# EAGLE design MainBoard 1.4.1 (EAGLE 9.5.1)
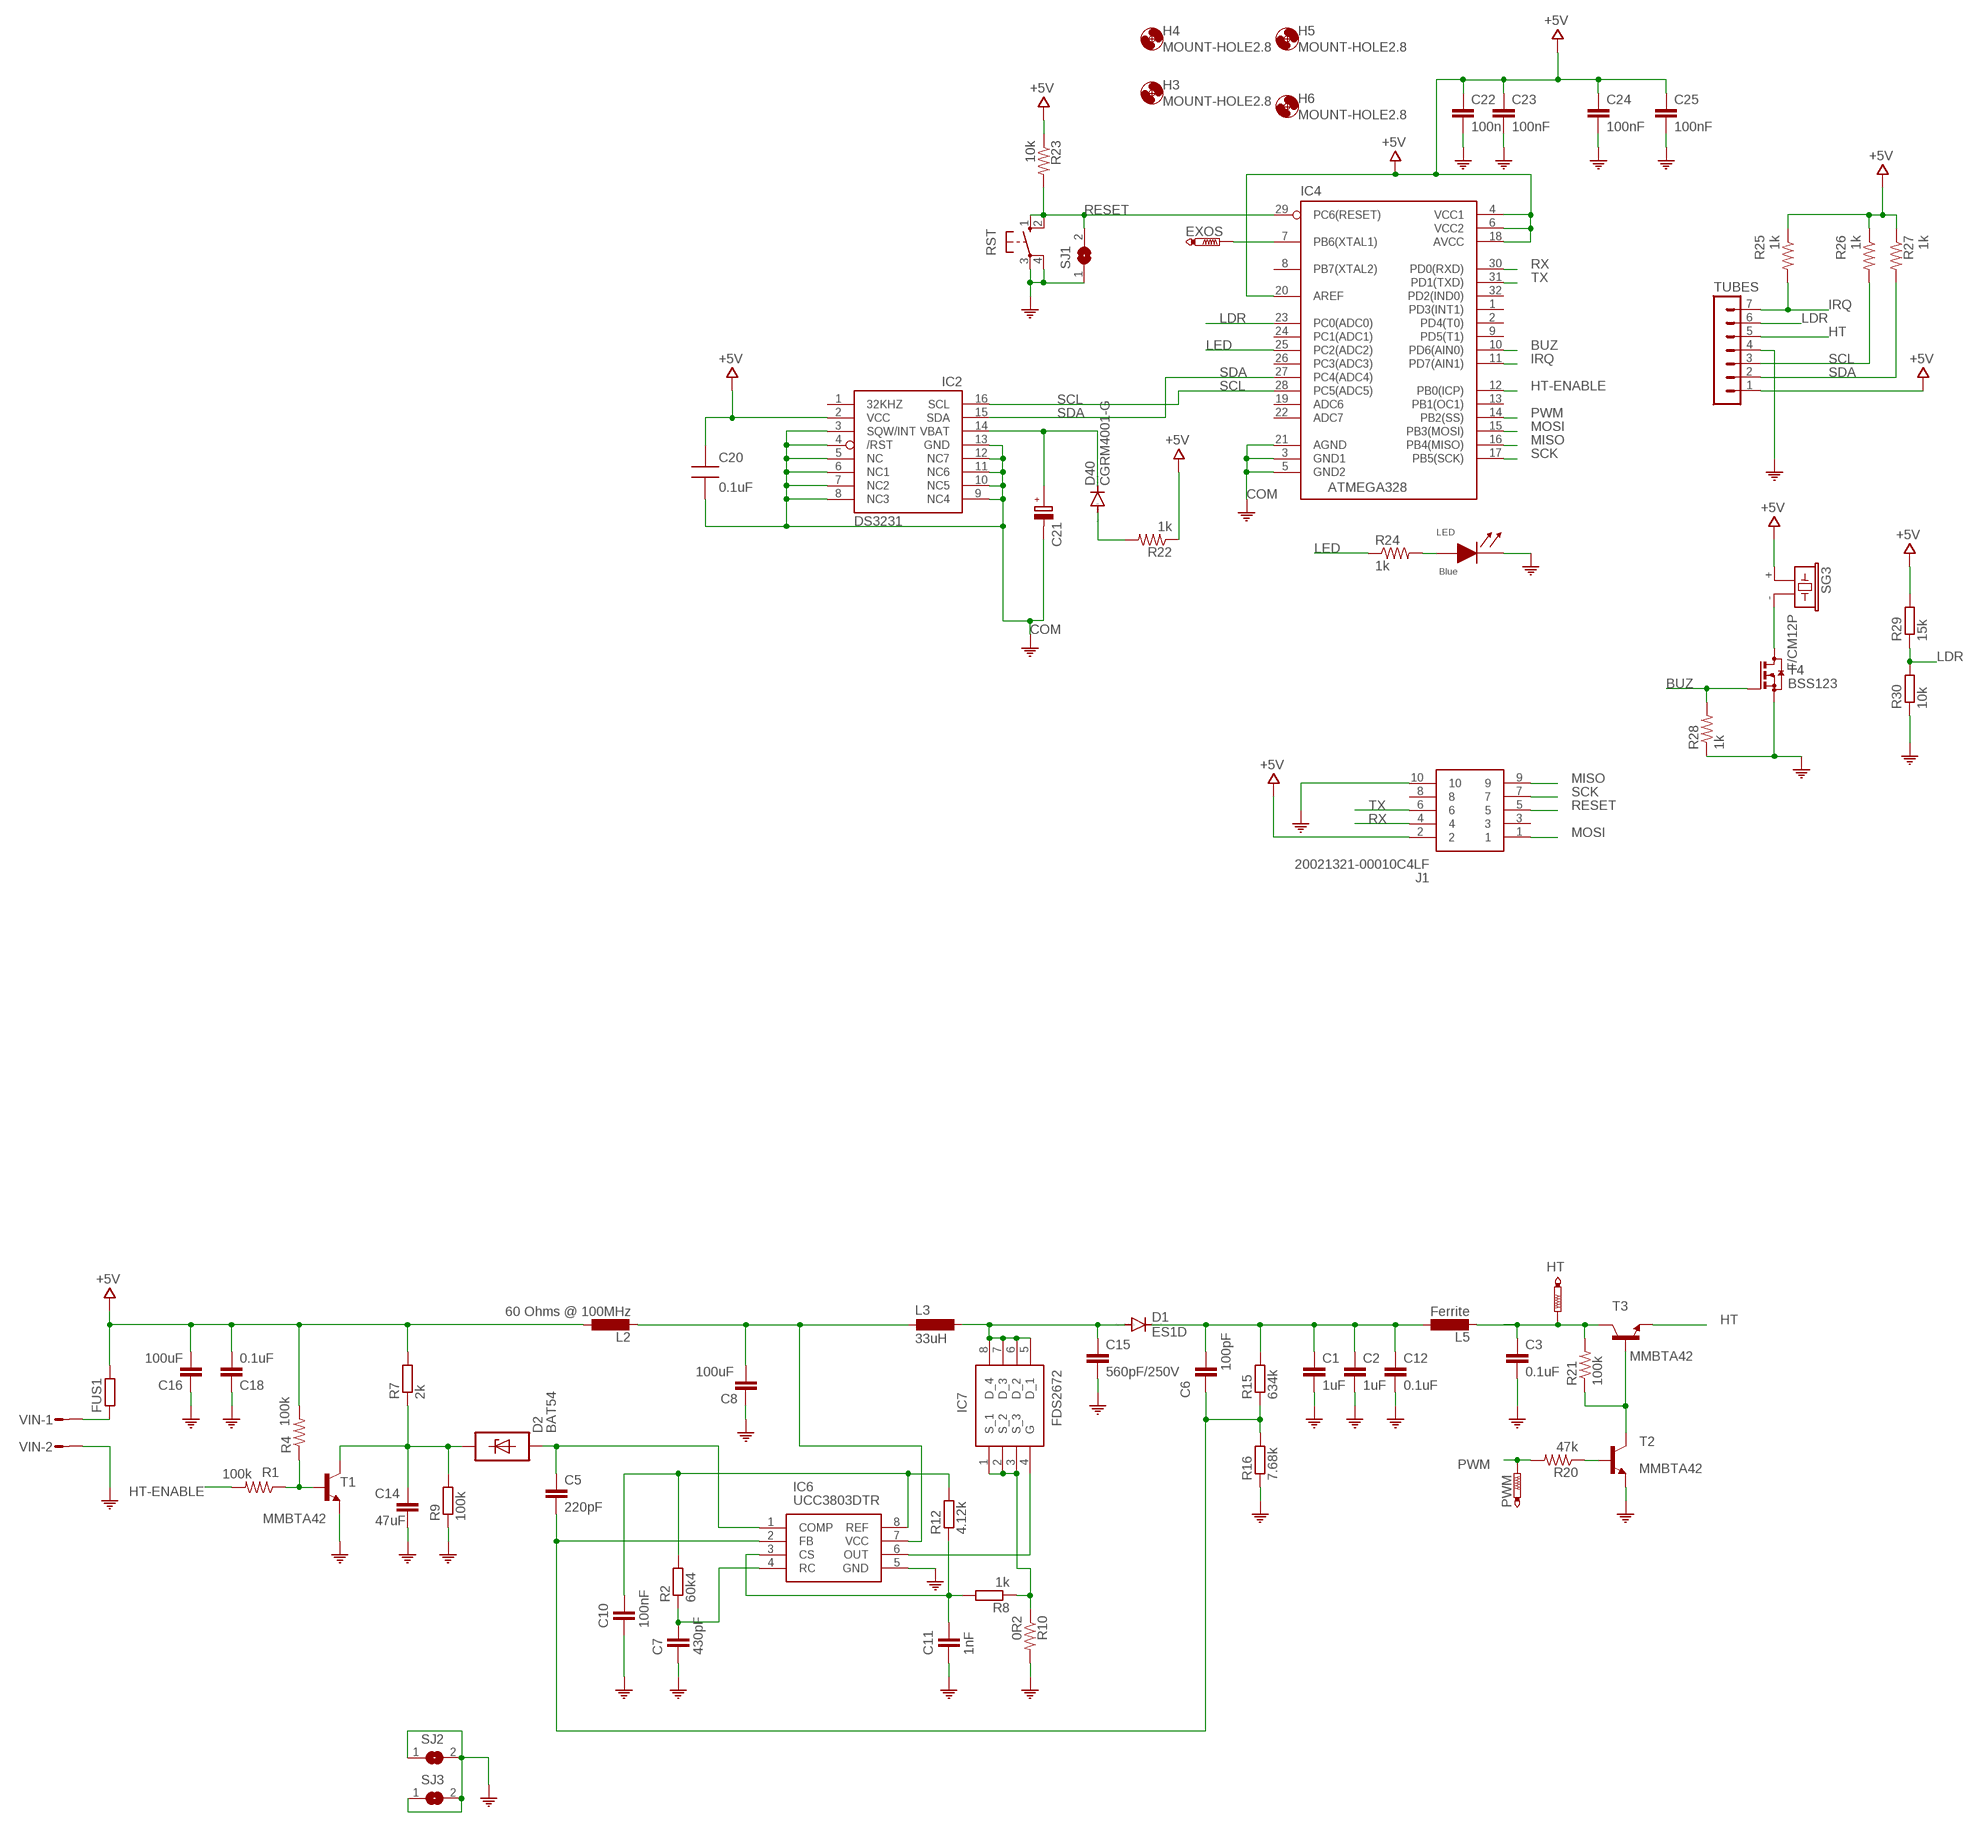
[diagram p0: schematic, sheet 1]

## Parts
C1  1uF  C-EUC1812K  [C1812K]
C2  1uF  C-EUC1812K  [C1812K]
C3  0.1uF  C-EUC1808  [C1808]
C5  220pF  C-EUC0805K  [C0805K]
C6  100pF  C-EUC0805  [C0805]
C7  430pF  C-EUC0805  [C0805]
C8  100uF  C-EUC1210  [C1210]
C10  100nF  C-EUC0805  [C0805]
C11  1nF  C-EUC0805  [C0805]
C12  0.1uF  C-EUC1808  [C1808]
C14  47uF  C-EUC1210  [C1210]
C15  560pF/250V  C-EUC0603  [C0603]
C16  100uF  C-EUC1210  [C1210]
C18  0.1uF  C-EUC0805  [C0805]
C20  0.1uF  CAP0805-NP  [CAP0805-NP]
C21  AHG-35/100-RADIAL  [ELNA21.5X8.0]
C22  100n  C-EUC0603  [C0603]
C23  100nF  C-EUC0603  [C0603]
C24  100nF  C-EUC0603  [C0603]
C25  100nF  C-EUC0603  [C0603]
D1  ES1D  ES2D  [SMB]
D2  BAT54  SP4020-01FTG  [SOD323]
D40  CGRM4001-G  [SOD-123_MINI-SMA]
EXOS  PTR1TP09R  [TP09R]
FUS1  R-EU_R6332  [R6332]
H3  MOUNT-HOLE2.8  [2,8]
H4  MOUNT-HOLE2.8  [2,8]
H5  MOUNT-HOLE2.8  [2,8]
H6  MOUNT-HOLE2.8  [2,8]
HT  PTR1TP09R  [TP09R]
IC2  DS3231/SO  [SO16W]
IC4  ATMEGA328  ATMEGA168-20AU  [QFP032]
IC6  UCC3803DTR  [SOIC127P600X175-8N]
IC7  FDS2672  [SOIC127P600X175-8N]
J1  20021321-00010C4LF  [2002132100010C4LF]
L2  60 Ohms @ 100MHz  L-EUL2012C  [L2012C]
L3  33uH  MSS7341  [MSS7341]
L5  Ferrite  L-EUL2012C  [L2012C]
LED  Blue  LED0805  [LED0805]
PWM  PTR1TP09R  [TP09R]
R1  100k  R-US_R0805  [R0805]
R2  60k4  R-EU_R0805  [R0805]
R4  100k  R-US_R0805  [R0805]
R7  2k  R-EU_R0805  [R0805]
R8  1k  R-EU_R0805  [R0805]
R9  100k  R-EU_R0805  [R0805]
R10  0R2  R-US_R2010  [R2010]
R12  4.12k  R-EU_R0805  [R0805]
R15  634k  R-EU_R0805  [R0805]
R16  7.68k  R-EU_R0805  [R0805]
R20  47k  R-US_R2012  [R2012]
R21  100k  R-US_R2012  [R2012]
R22  1k  R-US_M2012  [M2012]
R23  10k  R-US_M2012  [M2012]
R24  1k  R-US_M2012  [M2012]
R25  1k  R-US_M2012  [M2012]
R26  1k  R-US_M2012  [M2012]
R27  1k  R-US_M2012  [M2012]
R28  1k  R-US_M2012  [M2012]
R29  15k  R-EU_0204/2V  [0204V]
R30  10k  R-EU_M2012  [M2012]
RST  10-XX  [B3F-10XX]
SG3  F/CM12P  [F/CM12P]
SJ1  SJW  [SJW]
SJ2  SJW  [SJW]
SJ3  SJW  [SJW]
T1  MMBTA42  BC846  [SOT23]
T2  MMBTA42  BC846  [SOT23]
T3  MMBTA42  BC846  [SOT23]
T4  BSS123  [SOT23]
TUBES  MA07-1  [MA07-1]
VIN  M02S  [02P]

## Nets
+5V [pwr]: C16.2 C18.1 C20.1 C22.1 C23.1 C24.1 C25.1 FUS1.2 IC2.2(VCC) IC4.4(VCC1) IC4.6(VCC2) IC4.18(AVCC) IC4.20(AREF) J1.2 L2.1 R4.2 R7.2 R22.1 R23.1 R25.1 R26.1 R27.1 R29.2 SG3.+ TUBES.1
BATT: C21.+ D40.C IC2.14(VBAT)
BUZ: IC4.10(PD6(AIN0)) R28.2 T4.1(G)
COM: C1.2 C2.2 C3.2 C7.2 C8.1 C10.2 C11.2 C12.2 C14.2 C15.2 C16.1 C18.2 C20.2 C21.- C22.2 C23.2 C24.2 C25.2 IC2.3(SQW/INT) IC2.4(/RST) IC2.5(NC) IC2.6(NC1) IC2.7(NC2) IC2.8(NC3) IC2.9(NC4) IC2.10(NC5) IC2.11(NC6) IC2.12(NC7) IC2.13(GND) IC4.3(GND1) IC4.5(GND2) IC4.21(AGND) IC6.5(GND) J1.10 LED.1(CA) R9.1 R10.2 R16.1 R28.1 R30.1 RST.3(P) RST.4(P1) SJ1.1 SJ2.1 SJ2.2 SJ3.1 SJ3.2 T1.2(E) T2.2(E) T4.2(S) TUBES.4 VIN.2
CS: C11.1 IC6.3(CS) R8.2 R12.1
FB: C5.2 C6.2 IC6.2(FB) R15.1 R16.2
HT: T3.2(E) TUBES.5
HT-ENABLE: IC4.12(PB0(ICP)) R1.2
IRQ: IC4.11(PD7(AIN1)) R25.2 TUBES.7
LDR: IC4.23(PC0(ADC0)) R29.1 R30.2 TUBES.6
LED: IC4.25(PC2(ADC2)) R24.1
MISO: IC4.16(PB4(MISO)) J1.9
MOSI: IC4.15(PB3(MOSI)) J1.1
N$3: SG3.- T4.3(D)
N$5: EXOS.TP IC4.7(PB6(XTAL1))
N$6: C1.1 C2.1 C6.1 C12.1 D1.C L5.1 R15.2
N$7: R21.1 T2.3(C) T3.1(B)
N$8: R1.1 R4.1 T1.1(B)
N$9: C14.1 D2.C R7.1 R9.2 T1.3(C)
N$10: C5.1 D2.A IC6.1(COMP)
N$12: IC7.1(S_1) IC7.2(S_2) IC7.3(S_3) R8.1 R10.1
N$14 [pwr]: FUS1.1 VIN.1
N$15: LED.2(AN) R24.2
N$18: C15.1 D1.A IC7.5(D_1) IC7.6(D_2) IC7.7(D_3) IC7.8(D_4) L3.2
N$19: R20.1 T2.1(B)
N$23: D40.A R22.2
OUT: IC6.6(OUT) IC7.4(G)
PWM: IC4.14(PB2(SS)) PWM.TP R20.2
RAW_HT: C3.1 HT.TP L5.2 R21.2 T3.3(C)
RC: C7.1 IC6.4(RC) R2.1
REF: C10.1 IC6.8(REF) R2.2 R12.2
RESET: IC4.29(PC6(RESET)) J1.5 R23.2 RST.1(S) RST.2(S1) SJ1.2
RX: IC4.30(PD0(RXD)) J1.4
SCK: IC4.17(PB5(SCK)) J1.7
SCL: IC2.16(SCL) IC4.28(PC5(ADC5)) R26.2 TUBES.3
SDA: IC2.15(SDA) IC4.27(PC4(ADC4)) R27.2 TUBES.2
TX: IC4.31(PD1(TXD)) J1.6
VCC [pwr]: C8.2 IC6.7(VCC) L2.2 L3.1
Unconnected: IC2.1(32KHZ) IC4.1(PD3(INT1)) IC4.2(PD4(T0)) IC4.8(PB7(XTAL2)) IC4.9(PD5(T1)) IC4.13(PB1(OC1)) IC4.19(ADC6) IC4.22(ADC7) IC4.24(PC1(ADC1)) IC4.26(PC3(ADC3)) IC4.32(PD2(IND0)) J1.3 J1.8

## Library data of the parts
C1 C2 = rcl:C-EU: CAPACITOR, European symbol; MOUSER: 810-C4532X7T2E105MST; SPICEPREFIX: C; TDK: C4532X7T2E105M250KE
C3 C12 = rcl:C-EU: CAPACITOR, European symbol; KEMET: CAN17C104KARACTU; MOUSER: 80-CAN17C104KARACTU; SPICEPREFIX: C
C5 C14 C15 C18 C22-C25 = rcl:C-EU: CAPACITOR, European symbol; SPICEPREFIX: C
C6 C7 C10 C11 = rcl:C-EU: CAPACITOR, European symbol; MOUSER: 791-0603X106K100CT; SPICEPREFIX: C
C8 C16 = rcl:C-EU: CAPACITOR, European symbol; MOUSER: 963-EMK325ABJ107MM-P; SPICEPREFIX: C; TAIYO_YUDEN: EMK325ABJ107MM-P
C20 = MySMD:CAP0805-NP
C21 = Elkos:AHG-35/100-RADIAL: AUDYN® - AHG Gepolt, radial High Grade AHG Gepolter Elekrolytkondensator für Audio-Netzteile, oder Verstärker im Home- und Car-Bereich. Technische Daten Anschlußdrähte: Kupfer, verzinnt AL: ? mm d2ø : ? mm Kapazitätsbereich: von 10 µF bis 2200 µF Nennspannungen: 25 V, 35 V, 50 V, 100 V C-Toleranz: 20 % ( bei 20° C ) Verlustfaktor: tan δ < 0,100 @ 1 kHz Temperaturbereich: - 40° C bis 85° C Verzerrung: sehr gering bei 10 kHz, 010 A - 120 dB oder niedriger gepolt AHG AUDYN® - AHG gepolt Bezeichnung C U DxH Rm Bestell.-Nr. U / Volt D x L/mm mm AHG/10.0/100V 10µF 100V 10x15 5,0 1341690 AHG/22.0/50V 22µF 50V 10x13 5,0 1341691 AHG/47.0/50V 47µF 50V 10x16 5,0 1341692 AHG/100.0/50V 100µF 50V 13x21 5,0 1341693 AHG/220.0/50V 220µF 50V 16x25 7,5 1341694 AHG/470.0/50V 470µF 50V 16x37 7,5 1341695 AHG/1000/35V 1000µF 35V 18x37 7,5 1341696 AHG/2200/35V 2200µF 35V 22x38 10,0 1341697 Alle Abmessungen in mm; MOUSER: 555-DB-5R5D474T
D1 = diode:ES2D: DIODE super fast rectifier, 2 A
D2 = sp4020_11:SP4020-01FTG: SP4020 Series 2.5pF, 30A Discrete TVS Diode Source: http://www.littelfuse.com/~/media/electronics/datasheets/tvs_diode_arrays/littelfuse_tvs_diode_array_sp4020_datasheet.pdf.pdf; MF: Littelfuse; MPN: SP4020-01FTG; OC_FARNELL: unknown; OC_NEWARK: 05X0400
D40 = diode:CGRM400*-G: Molded plasitc,JEDEC SOD-123/Mini SMA Source: Comchip CGRM4001-G.pdf; MOUSER: 863-NSR0320MW2T1G
EXOS HT PWM = testpad:PTR1: TEST PIN
FUS1 = rcl:R-EU_: RESISTOR, European symbol; MOUSER: 530-0ZCG0150AF2C; SPICEPREFIX: R
H3-H6 = holes:MOUNT-HOLE: MOUNTING HOLE with drill center marker
IC2 = DS3231:DS3231: The DS3231 is a low-cost, extremely accurate I²C real-time clock (RTC) with an integrated temperature-compensated crystal oscillator (TCXO) and crystal. The device incorporates a battery input, and maintains accurate timekeeping when main power to the device is interrupted.; AVAILABILITY: Unavailable; MF: Maxim Integrated; MP: DS3231; PACKAGE: SOIC-16 Maxim Integrated; PRICE: None
IC4 = MySMD:ATMEGA168-20AU
IC6 = UCC3803DTR:UCC3803DTR: Switching Controllers Low-Power BiCMOS Current-Mode PWM Source: Datasheet <http://www.ti.com/lit/ds/symlink/ucc3803.pdf>; DESCRIPTION: Switching Controllers Low-Power BiCMOS Current-Mode PWM; HEIGHT: 1.75mm; MANUFACTURER_NAME: Texas Instruments; MANUFACTURER_PART_NUMBER: UCC3803DTR; MOUSER_PART_NUMBER: 595-UCC3803DTR; MOUSER_PRICE-STOCK: https://www.mouser.com/Search/Refine.aspx?Keyword=595-UCC3803DTR
IC7 = FDS2672:FDS2672: FDS2672, N-channel MOSFET Transistor 3.9 A 200 V, 8-Pin SOIC Source: Datasheet <http://docs-emea.rs-online.com/webdocs/0d23/0900766b80d23481.pdf>; DESCRIPTION: FDS2672, N-channel MOSFET Transistor 3.9 A 200 V, 8-Pin SOIC; HEIGHT: 1.75mm; MANUFACTURER_NAME: Fairchild Semiconductor; MANUFACTURER_PART_NUMBER: FDS2672; MOUSER_PART_NUMBER: 512-FDS2672; MOUSER_PRICE-STOCK: https://www.mouser.com/Search/Refine.aspx?Keyword=512-FDS2672; RS_PART_NUMBER: 6710481P; RS_PRICE-STOCK: http://uk.rs-online.com/web/p/products/6710481P
J1 = SamacSys_Parts:20021321-00010C4LF: Headers & Wire Housings 1.27x1.27mm BTB, Hdr Recept, SMT, 10 Pos Source: Datasheet <https://componentsearchengine.com/Datasheets/1/20021321-00010C4LF.pdf>; DESCRIPTION: Headers & Wire Housings 1.27x1.27mm BTB, Hdr Recept, SMT, 10 Pos; HEIGHT: 4.75mm; MANUFACTURER_NAME: Amphenol; MANUFACTURER_PART_NUMBER: 20021321-00010C4LF; MOUSER_PART_NUMBER: 649-202132100010C4LF; MOUSER_PRICE-STOCK: https://www.mouser.com/Search/Refine.aspx?Keyword=649-202132100010C4LF
L2 L5 = rcl:L-EU: INDUCTOR, European symbol; SPICEPREFIX: L
L3 = STEAM-inductor-coilcraft:MSS7341: Shielded Power Inductors Package 6.6 × 6.6 mm x 4.1 mm high Source: http://www.farnell.com/datasheets/1681958.pdf; MOUSER: 710-784770330
LED = MySMD:LED0805
R1 R4 R10 R20-R28 = adafruit:R-US_: RESISTOR, American symbol
R2 R8 R9 = rcl:R-EU_: RESISTOR, European symbol; SPICEPREFIX: R
R7 = rcl:R-EU_: RESISTOR, European symbol; MOUSER: 754-RR1220P-202D; SPICEPREFIX: R; SUSUMU: RR1220P-202-D
R12 = rcl:R-EU_: RESISTOR, European symbol; KOASPEER: RN732ATTD4121F100; MOUSER: 660-RN732ATD4121F100; SPICEPREFIX: R
R15 = rcl:R-EU_: RESISTOR, European symbol; MOUSER: 71-CRCW0603-634K-E3; SPICEPREFIX: R; VISHAY: CRCW0603634KFKEA
R16 = rcl:R-EU_: RESISTOR, European symbol; MOUSER: 71-CRCW0805-7.68K-E3; SPICEPREFIX: R; VISHAY: CRCW08057K68FKEA
R29 R30 = resistor:R-EU_: RESISTOR, European symbol
RST = switch-omron:10-XX: OMRON SWITCH; MPN: B3F-1000; OC_FARNELL: 176432; OC_NEWARK: 36M3542
SG3 = buzzer:F/CM12P: BUZZER Source: Buerklin; OC_FARNELL: unknown; OC_NEWARK: unknown
SJ1-SJ3 = jumper:SJ: SMD solder JUMPER
T1-T3 = transistor:BC846: NPN TRANSISTOR
T4 = transistor-small-signal:BSS123: N-CHANNEL MOS FET
TUBES = con-lstb:MA07-1: PIN HEADER; OC_FARNELL: unknown; OC_NEWARK: unknown
VIN = con-amp-quick:M02S: AMP QUICK CONNECTOR; OC_FARNELL: unknown; OC_NEWARK: unknown

## Module TUBEIN16
Ports: 

### Library data of the parts

## Net classes
0 default: width 0.254 mm, clearance 0.254 mm
1 pwr: width 0.254 mm, clearance 0.356 mm

## Board
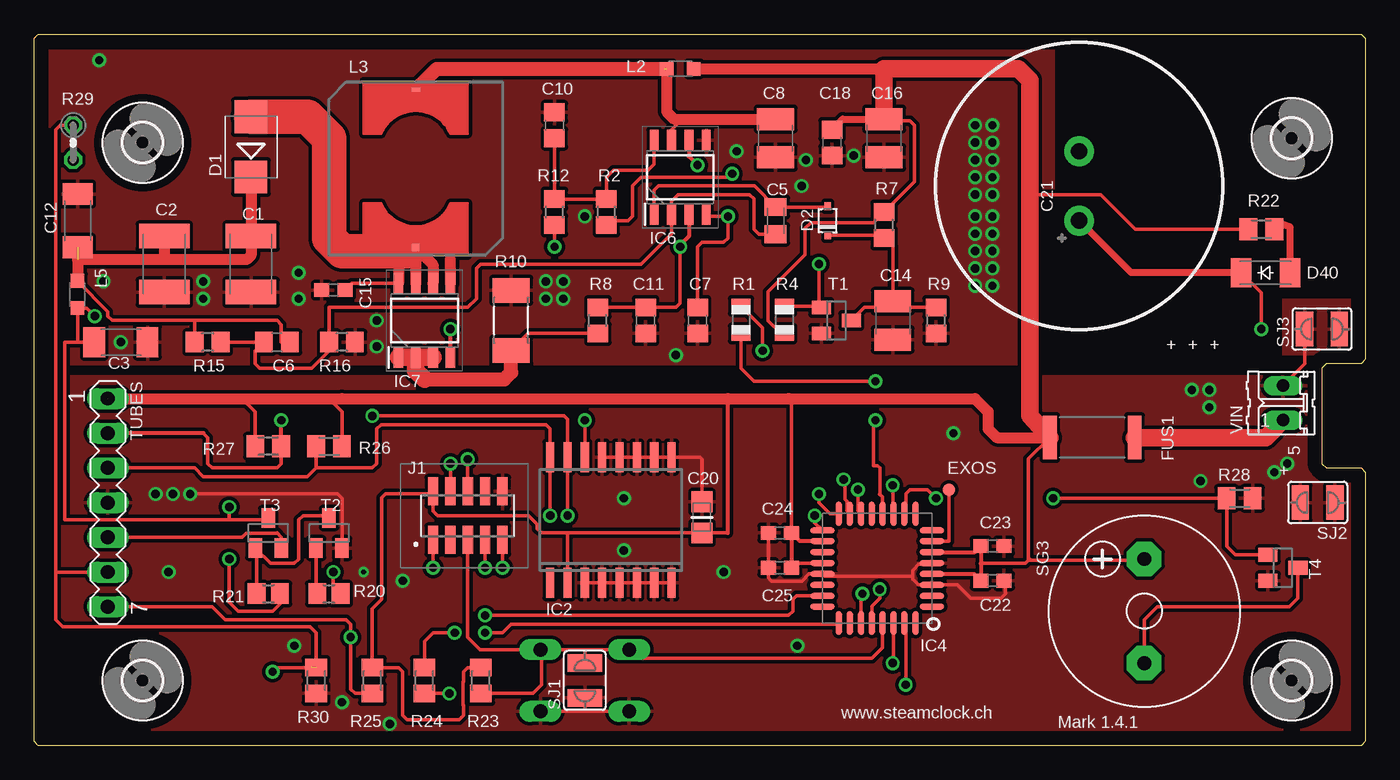
[diagram p1: board, top side]
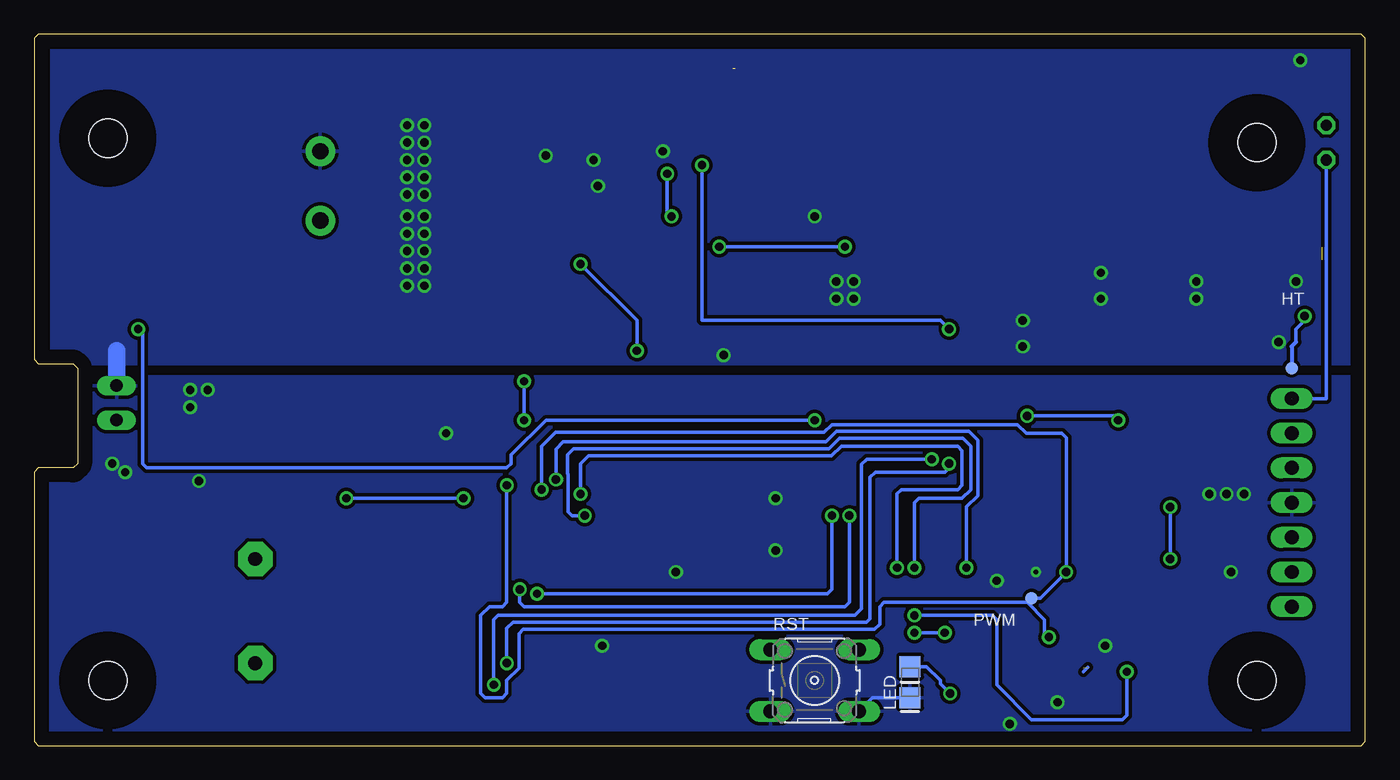
[diagram p2: board, bottom side, seen from below]

Size 97.47 x 52.07 mm. Coordinates in mm from the lower left corner, seen from the top.
Outline: 0.32,52.07 97.16,52.07 97.47,51.75 97.47,28.26 97.16,27.94 94.61,27.94 94.3,27.62 94.3,20.64 94.61,20.32 97.16,20.32 97.47,20 97.47,0.32 97.16,0 0.32,0 0,0.32 0,51.75 0.32,52.07
Copper layers (1*16): Top 0.035mm / dielectric 1.5mm / Bottom 0.035mm
Design rules "default": minimum track width 10mil, minimum drill 24mil, track to track 8mil, track to pad 8mil, pad to pad 8mil, via to via 8mil, smd to smd 8mil, copper to edge 40mil, drill to drill 8mil, minimum pad ring 10mil, minimum via ring 8mil, stop-mask expansion 4mil, vias tented up to drill 0mil, thermal gap 10mil

### Footprints (pad centres in the part's own frame; a part is rotated, then mirrored left to right if it is on the bottom)
C1812K = smd 1.8 x 3.7: 1 -2.05,0; 2 2.05,0
C1808 = smd 1.6 x 2.2: 1 -1.95,0; 2 1.95,0
C0805K = smd 1.3 x 1.6: 1 -1,0; 2 1,0
C0805 = smd 1.3 x 1.5: 1 -0.95,0; 2 0.95,0
C1210 = smd 1.6 x 2.7: 1 -1.4,0; 2 1.4,0
C0603 = smd 1.1 x 1: 1 -0.85,0; 2 0.85,0
CAP0805-NP = smd 1.524 x 1.524: 1 0,0; 2 2.286,0
ELNA21.5X8.0 = drill 1.2 pad 2.184: + -2.54,0; - 2.54,0
SMB = smd 2.4 x 2.4: A 2.2,0; C -2.2,0
SOD323 = smd 0.6 x 0.45: A 1.06,0; C -1.06,0
SOD-123_MINI-SMA = smd 1.5 x 2.1: A 1.8,0; C -1.8,0
TP09R = smd 0.9 x 0.9: TP 0,0
R6332 = smd 1 x 3.2: 1 -3.1,0; 2 3.1,0
2,8 = hole 2.8: 0,0
SO16W = smd 0.6 x 2.2: 1 -4.445,-4.6; 2 -3.175,-4.6; 3 -1.905,-4.6; 4 -0.635,-4.6; 5 0.635,-4.6; 6 1.905,-4.6; 7 3.175,-4.6; 8 4.445,-4.6; 9 4.445,4.6; 10 3.175,4.6; 11 1.905,4.6; 12 0.635,4.6; 13 -0.635,4.6; 14 -1.905,4.6; 15 -3.175,4.6; 16 -4.445,4.6
QFP032 = smd 0.432 x 1.778: 1 0,0; 2 0.8,0; 3 1.599,0; 4 2.399,0; 5 3.199,0; 6 3.998,0; 7 4.798,0; 8 5.598,0; 17 5.588,8.001; 18 4.798,7.997; 19 3.998,7.997; 20 3.199,7.997; 21 2.399,7.997; 22 1.599,7.997; 23 0.799,7.997; 24 0,7.997 | smd 1.778 x 0.432: 9 6.807,1.194; 10 6.807,2.007; 11 6.807,2.794; 12 6.807,3.607; 13 6.807,4.394; 14 6.807,5.182; 15 6.807,5.994; 16 6.816,6.803; 25 -1.194,6.807; 26 -1.194,5.994; 27 -1.194,5.182; 28 -1.194,4.394; 29 -1.194,3.607; 30 -1.194,2.794; 31 -1.194,2.007; 32 -1.194,1.194
SOIC127P600X175-8N = smd 1.525 x 0.65: 1 -2.712,1.905; 2 -2.712,0.635; 3 -2.712,-0.635; 4 -2.712,-1.905; 5 2.712,-1.905; 6 2.712,-0.635; 7 2.712,0.635; 8 2.712,1.905
SOIC127P600X175-8N' = smd 1.525 x 0.7: 1 -2.712,1.905; 2 -2.712,0.635; 3 -2.712,-0.635; 4 -2.712,-1.905; 5 2.712,-1.905; 6 2.712,-0.635; 7 2.712,0.635; 8 2.712,1.905
2002132100010C4LF = smd 0.76 x 2.05: 1 2.54,1.775; 2 2.54,-1.775; 3 1.27,1.775; 4 1.27,-1.775; 5 0,1.775; 6 0,-1.775; 7 -1.27,1.775; 8 -1.27,-1.775; 9 -2.54,1.775; 10 -2.54,-1.775
L2012C = smd 1 x 1: 1 -1,0; 2 1,0
MSS7341 = smd 0.61 x 0.305: 1 0,5.765 | smd 0.5 x 0.5: 2 0,-5.765
LED0805 = smd 1.524 x 1.524: 1 0,0; 2 2.286,0
R0805 = smd 1.1 x 1.4: 1 -1,0; 2 1,0
R0805' = smd 1.3 x 1.5: 1 -0.95,0; 2 0.95,0
R2010 = smd 1.8 x 2.7: 1 -2.2,0; 2 2.2,0
R2012 = smd 1.3 x 1.5: 1 -0.85,0; 2 0.85,0
M2012 = smd 1.3 x 1.6: 1 -0.95,0; 2 0.95,0
0204V = drill 0.813 octagon: 1 -1.27,0; 2 1.27,0
B3F-10XX = drill 1.016 long: 1 -3.251,2.261; 2 3.251,2.261; 3 -3.251,-2.261; 4 3.251,-2.261
F/CM12P = drill 1.016 pad 2.54 octagon: + 3.81,0; - -3.81,0
SJW = smd 1.27 x 2.54: 1 -1.27,0; 2 1.27,0
SOT23 = smd 1 x 1.4: 1 -0.95,-1.1; 2 0.95,-1.1; 3 0,1.1
MA07-1 = drill 1.016 long: 1 -7.62,0; 2 -5.08,0; 3 -2.54,0; 4 0,0; 5 2.54,0; 6 5.08,0; 7 7.62,0
02P = drill 0.914 long: 1 -1.27,0; 2 1.27,0

### Placement (x,y rotation side)
C1  15.88,35.24 270 top
C2  9.52,35.24 270 top
C3  6.35,29.53 0 top
C5  54.29,38.42 270 top
C6  17.78,29.53 180 top
C7  48.58,31.12 270 top
C8  54.29,44.45 90 top
C10  38.1,45.4 90 top
C11  44.77,31.12 270 top
C12  3.18,38.42 90 top
C14  62.86,31.12 270 top
C15  21.91,33.34 180 top
C16  62.23,44.45 90 top
C18  58.42,44.13 270 top
C20  48.9,15.56 90 top
C21  76.52,40.96 90 top
C22  70.17,12.06 0 top
C23  70.17,14.6 0 top
C24  54.61,15.56 180 top
C25  54.61,13.02 180 top
D1  15.88,43.81 90 top
D2  58.1,38.42 90 top
D40  90.17,34.61 0 top
EXOS  66.99,18.73 0 top
FUS1  77.47,22.54 180 top
H3  7.94,44.13 0 top
H4  7.94,4.76 0 top
H5  92.08,4.76 0 top
H6  92.08,44.45 0 top
HT  5.4,27.62 0 bottom
IC2  42.23,16.51 0 top
IC4  65.72,10.16 90 top
IC6  47.31,41.59 90 top
IC7  FDS2672  [SOIC127P600X175-8N']  28.58,31.12 90 top
J1  31.75,16.83 180 top
L2  47.31,49.53 180 top
L3  27.94,42.23 0 top
L5  3.18,33.02 270 top
LED  33.34,3.49 90 bottom
PWM  24.45,10.79 0 bottom
R1  51.75,31.16 270 top
R2  60k4  [R0805']  41.91,39.05 90 top
R4  54.93,31.16 270 top
R7  2k  [R0805']  62.23,38.1 90 top
R8  1k  [R0805']  41.27,31.12 90 top
R9  100k  [R0805']  66.04,31.12 90 top
R10  34.92,31.12 90 top
R12  4.12k  [R0805']  38.1,39.05 90 top
R15  634k  [R0805']  12.7,29.53 180 top
R16  7.68k  [R0805']  22.54,29.53 180 top
R20  21.59,11.11 0 top
R21  17.14,11.11 0 top
R22  89.85,37.78 0 top
R23  32.7,4.76 270 top
R24  28.58,4.76 270 top
R25  24.77,4.76 270 top
R26  21.59,21.91 180 top
R27  17.14,21.91 0 top
R28  88.27,18.1 180 top
R29  2.86,44.13 270 top
R30  20.64,4.76 90 top
RST  40.32,4.76 0 bottom
SG3  81.28,9.84 90 top
SJ1  40.32,4.76 90 top
SJ2  93.98,17.78 180 top
SJ3  94.3,30.48 180 top
T1  58.74,31.12 270 top
T2  21.59,15.56 0 top
T3  17.14,15.56 0 top
T4  91.44,13.02 270 top
TUBES  5.4,17.78 270 top
VIN  91.44,25.08 90 top

### Tracks (layer width: path | path; a pad name or v marks a point on that pad's centre or on a via)
+5V  (1 unrouted)
  Top 0.254: R27.1 16.2,24.45 15.24,25.4 TUBES.1 21.59,25.4 22.54,24.45 R26.1 | 22.54,25.4 | 55.46,13.12 C25.1 55.78,13.33 57.7,13.33 IC4.20 | 39.05,15.56 37.15,15.56 36.83,15.88 36.83,16.19 36.2,16.83 29.53,16.83 29.21,17.15 29.21,18.41 | 39.05,15.56 C20.1 50.8,15.56 | J1.2 29.21,18.41 | IC2.2 39.05,15.56 | 29.21,18.41 25.72,18.41 25.44,18.14 25.44,10.7 24.77,10.03 R25.1 26.67,5.71 26.99,5.4 26.99,2.22 27.3,1.91 31.12,1.91 31.43,2.22 31.43,2.95 31.42,2.96 31.42,4.66 31.43,4.68 31.43,5.4 31.75,5.71 R23.1 | 72.8,13.56 72.58,13.33 69.32,13.33 | 72.8,13.56 72.89,13.65 | R22.1 80.64,37.78 78.11,40.32 72.89,40.32 | C24.1 55.46,25.19 55.24,25.4 | C16.2 62.36,45.72 64.14,45.72 64.45,45.4 64.45,41.27 R7.2 61.46,38.28 56.87,38.28 56.44,37.86 56.44,35.93 53.74,33.23 53.74,31.09 54.68,30.16 R4.2 | 72.8,13.56 72.8,20.97 FUS1.2 | SG3.+ 81.19,13.56 72.8,13.56
  Top 0.305: IC4.4 68.82,12.56 C22.1 69.32,13.33 C23.1 68.87,14.16 IC4.6 | IC4.18 56.06,14.96 C24.1 C25.1 | 50.8,15.56 50.8,25.4
  Top 0.508: FUS1.2 74.05,22.23 | C18.1 59.19,45.85 C16.2
  Top 0.813: TUBES.1 22.54,25.4 50.8,25.4 55.24,25.4 68.9,25.4 69.85,24.45 69.85,23.18 70.48,22.54 FUS1.2 | L2.1 62.23,49.53
  Top 1.27: FUS1.2 72.89,24.13 72.89,40.32 72.89,48.71 72.07,49.53 62.23,49.53 C16.2
  Bottom 0.254: R29.2 2.86,25.4 TUBES.1
BATT  (via drill 0.61)
  Top 0.254: IC2.14 v40.32,23.81 | v89.85,30.48 89.85,33.12 D40.C
  Top 0.508: D40.C 80.33,34.61 C21.+
  Bottom 0.254: v40.32,23.81 60.01,23.81 62.55,21.27 62.55,20.64 62.86,20.32 89.22,20.32 89.53,20.64 89.53,30.48 v89.85,30.48
BUZ  (via drill 0.61)
  Top 0.254: IC4.10 63.82,17.07 63.82,18.41 64.14,18.73 65.41,18.73 v66.04,18.1 | T4.1 87.95,13.97 87.31,14.6 R28.2 v74.61,18.1
  Bottom 0.254: v66.04,18.1 v74.61,18.1
COM  (via drill 0.35, 0.61)
  Top 0.254: IC4.5 65.62,13.26 64.76,13.26 64.35,12.85 64.35,12.38 | 64.35,12.38 64.35,12.17 64.76,11.76 IC4.3 67.62,11.76 68.58,10.79 70.8,10.79 71.12,11.11 71.12,11.96 C22.2 | IC2.8 IC2.7 IC2.6 IC2.5 IC2.4 IC2.3 | 64.35,12.38 57.9,12.38 IC4.21 56.73,12.56 56.21,12.04 54.01,12.04 53.76,12.28 C25.2 C24.2 | IC2.13 IC2.12 IC2.11 IC2.10 IC2.9 48.74,21.11 48.9,20.95 C20.2 | v11.43,18.41 22.23,18.41 22.54,18.1 T2.2 | RST.3 40.32,2.5 | 40.32,2.5 RST.4 | SJ1.1 40.32,2.5 | SJ3.2 93.03,27.94 VIN.2
  Bottom 0.254: LED.1 36.08,3.49 RST.4
  Bottom 1.27: VIN.2 91.44,28.89
  other vias: 8.89,18.41 10.16,18.41 19.05,7.3 22.54,3.18 26.03,1.59 9.84,12.7 4.76,50.16 19.37,32.7 12.38,32.7 6.35,29.53 5.08,33.97 12.38,33.97 19.37,34.61 37.47,33.97 37.47,32.7 38.73,32.7 38.73,33.97 25.08,31.12 25.08,29.21 46.99,28.57 70.17,33.66 70.17,34.92 70.17,36.2 70.17,37.46 70.17,38.73 70.17,40.32 70.17,41.59 70.17,42.86 70.17,44.13 70.17,45.4 68.9,33.66 68.9,34.92 68.9,36.2 68.9,37.46 68.9,38.73 68.9,40.32 68.9,41.59 68.9,42.86 68.9,44.13 68.9,45.4 43.18,18.1 43.18,14.29 50.48,12.7 55.88,7.3 51.44,43.5 56.52,42.86 56.2,40.96 60.01,43.18 40.32,38.73 26.99,12.06 67.31,22.86 86.04,26.03 84.77,26.03 86.04,24.77 85.41,19.37 90.81,20 91.76,20.64 24.13,12.7
  pour Top: 0.32,51.12 74.61,51.12 74.61,27.94 0.32,27.94
  pour Bottom: -2.22,26.99 -2.22,-2.86 104.46,-2.86 104.46,26.99
  pour Top: -1.91,26.99 -1.91,0 96.52,0 96.52,26.99
  pour Bottom: 96.2,51.12 96.2,27.94 0.32,27.94 0.32,51.12
  pour Top: 91.44,32.7 96.52,32.7 96.52,28.57 91.44,28.57
CS  (via drill 0.61)
  Top 0.254: R12.1 v38.1,36.51 | v47.31,36.51 47.31,32.38 46.99,32.06 C11.1 R8.2
  Top 0.305: IC6.3 47.94,37.29 47.31,36.66 v47.31,36.51
  Bottom 0.254: v47.31,36.51 v38.1,36.51
FB
  Top 0.254: C5.2 53.07,37.42 52.7,37.78 52.7,40 52.39,40.32 47.16,40.32 46.67,39.83 IC6.2 46.67,37.46 44.45,35.24 32.7,35.24 32.38,34.92 32.38,32.7 31.75,32.07 21.59,32.07 R16.2 21.59,28.89 20.32,27.62 16.51,27.62 16.19,27.94 16.19,28.89 C6.2 R15.1
HT
  Top 0.254: TUBES.5 15.24,15.24 15.54,15.54 17.76,15.54 17.78,15.56 18.09,15.24 T3.2
HT-ENABLE  (via drill 0.61)
  Top 0.254: IC4.12 62.12,18.2 61.91,18.41 61.91,20.32 61.76,20.47 61.47,20.47 61.47,23.68 v61.59,23.81 | v61.59,26.67 52.7,26.67 51.75,27.62 R1.2
  Bottom 0.254: v61.59,23.81 v61.59,26.67
IRQ  (via drill 0.61)
  Top 0.254: IC4.11 62.86,17.03 v62.86,19.05 | R25.2 24.13,3.81 23.5,3.81 23.18,4.13 v23.18,7.94 23.18,8.89 22.86,9.21 13.97,9.21 13.02,10.16 TUBES.7
  Bottom 0.254: v23.18,7.94 23.5,8.26 23.5,9.21 24.77,10.48 35.24,10.48 35.56,10.16 35.56,8.89 35.94,8.51 61.66,8.51 61.98,8.19 61.98,5.66 62.86,4.78 62.86,3.81 63.18,3.49 64.45,3.49 64.77,3.81 64.77,9.53 64.14,10.16 63.18,10.16 62.86,10.48 v62.86,19.05
LDR  (via drill 0.61)  (1 unrouted)
  Top 0.254: IC4.23 55.81,10.96 55.56,10.71 55.56,9.84 55.24,9.53 v33.02,9.53 | R30.2 20.64,8.26 20.19,8.7 2.08,8.7 1.59,9.2 1.59,12.7 | 20.95,5.4 R30.2 | R29.1 1.9,45.4 1.59,45.09 1.59,12.7 | TUBES.6 1.59,12.7 | v17.46,5.4 17.78,5.71 R30.2
  Bottom 0.254: 20.32,5.71 20.64,5.4 | v17.46,5.4 17.46,2.22 17.78,1.91 24.45,1.91 26.99,4.45 26.99,9.21 27.3,9.53 v33.02,9.53
LED  (via drill 0.61)
  Top 0.254: IC4.25 58.84,8.89 34.92,8.89 34.29,8.26 v33.02,8.26 | v30.8,8.26 29.21,8.26 28.58,7.62 R24.1
  Bottom 0.254: v33.02,8.26 v30.8,8.26
MISO  (via drill 0.61)
  Top 0.254: J1.9 v34.29,13.02 | IC4.16 58.27,16.98 57.47,17.78 v57.47,18.41
  Bottom 0.254: v34.29,13.02 34.29,18.41 33.97,18.73 29.84,18.73 29.53,19.05 29.53,21.59 29.84,21.91 38.38,21.91 39.08,21.21 56.9,21.21 57.47,20.64 v57.47,18.41
MOSI  (via drill 0.61)
  Top 0.254: J1.1 v29.21,13.02 | IC4.15 59.52,17.18 59.52,17.9 59.37,18.04 59.37,19.37 v59.27,19.47
  Bottom 0.254: v29.21,13.02 29.21,17.46 28.38,18.29 28.38,22.35 29.02,22.99 38.73,22.99 39.5,22.23 58.74,22.23 59.27,21.69 v59.27,19.47
N$3
  Top 0.254: T4.3 92.54,10.79 91.91,10.16 82.23,10.16 81.28,9.21 SG3.-
N$5
  Top 0.254: IC4.7 66.99,14.96 EXOS.TP
N$6  (1 unrouted)
  Top 0.254: C6.1 18.1,29.53 18.1,30.8 17.78,31.12 11.75,31.12 | R15.2 11.75,31.12 | L5.1 3.18,33.97 5.4,31.75 5.4,31.43 5.71,31.12 11.75,31.12
  Top 0.813: D1.C C1.1 15.87,35.88 15.56,35.56 9.52,35.56 | 9.52,35.56 3.18,35.56 | C2.1 9.52,35.56 | C12.1 L5.1
N$7
  Top 0.254: T2.3 21.42,16.83 19.68,16.83 19.37,16.51 19.37,13.65 19.05,13.33 17.32,13.33 T3.1 16.3,14.36 R21.1
N$8  (via drill 0.61)
  Top 0.254: R4.1 57.47,32.16 | 57.47,32.16 57.54,32.16 T1.1 | R1.1 53.34,30.57 v53.34,28.89 | v57.47,35.24 57.47,32.16
  Bottom 0.254: v57.47,35.24 53.34,31.12 v53.34,28.89
N$9
  Top 0.254: D2.C 62.02,37.36 R7.1 62.86,36.52 C14.1 63.31,32.06 R9.2 60.79,32.06 T1.3
N$10
  Top 0.254: IC6.1 45.4,40.64 45.72,40.96 52.75,40.96 C5.1 58.04,39.42 D2.A
N$12
  Top 0.254: R8.1 36.17,30.16 R10.1
  Top 1.016: 28.58,26.8 34.42,26.8 34.92,27.3 R10.1
  Top 1.27: IC7.1 IC7.2 | IC7.2 IC7.3 | 28.58,26.8 27.94,27.43 IC7.2
N$14
  Top 1.27: VIN.1 90.17,22.54 FUS1.1
N$15  (via drill 0.61)
  Top 0.254: R24.2 v30.4,3.81
  Bottom 0.254: v30.4,3.81 31.12,4.52 31.12,4.76 32.13,5.78 LED.2
N$18
  Top 0.254: C15.1 23.25,33.83 IC7.8 | 27.99,36.83 27.94,36.78 L3.2 | L3.2 27.67,36.2 27.3,36.2 27.94,35.56 | L3.2 27.04,35.56 26.67,35.56 | L3.2 28.31,36.83 29.21,36.83 30.48,35.56
  Top 0.813: 29.21,36.83 29.53,37.15 29.53,36.51 | 27.94,35.56 IC7.7 | L3.2 29.21,35.19 IC7.6 | IC7.5 30.48,35.56 | 26.67,35.56 IC7.8
  Top 1.27: 27.99,35.96 27.99,36.83
  Top 2.54: D1.A 20.02,46.02 21.59,44.45 21.59,37.15 22.54,36.2 27.3,36.2
N$19
  Top 0.254: R20.1 20.64,11.21 T2.1
N$23
  Top 0.508: D40.A 91.97,37.94 91.17,38.23 R22.2
OUT  (via drill 0.61)
  Top 0.254: 30.48,30.16 v30.48,30.48
  Top 0.305: IC7.4 30.48,30.16 | IC6.6 47.94,43.12 v48.58,42.48
  Bottom 0.254: v30.48,30.48 31.12,31.12 48.58,31.12 v48.58,42.48
PWM  (via drill 0.61)
  Top 0.254: v60.33,18.73 60.33,17.18 IC4.14 | R20.2 21.91,11.65 v21.91,12.7
  Bottom 0.254: PWM.TP 23.81,10.79 v21.91,12.7 21.91,22.54 22.23,22.86 24.83,22.86 25.46,23.49 39.05,23.49 39.62,22.92 59.31,22.92 60.33,21.91 v60.33,18.73
RAW_HT  (via drill 0.61)
  Top 0.254: T3.3 17,16.51 14.29,16.51 | 14.29,16.51 2.22,16.51 2.22,29.53 3.18,29.53 | 3.18,29.53 L5.2 3.86,32.02 v4.45,31.43 | C3.1 3.18,29.53 | R21.2 18,10.38 17.46,9.84 14.92,9.84 14.29,10.48 v14.29,13.65 | v14.29,17.46 14.29,16.51
  Bottom 0.254: v14.29,13.65 v14.29,17.46 | 5.08,29.53 5.08,30.48 4.45,31.12 v4.45,31.43
  Bottom 0.305: 5.08,29.53 5.4,29.21 HT.TP
RC  (via drill 0.61)
  Top 0.254: IC6.4 49.21,38.73 v50.8,38.73 50.8,37.15 50.48,36.83 48.9,36.83 48.58,36.51 C7.1 | R2.1 42.23,38.42 43.5,38.42 43.81,38.73 43.81,40.96 44.45,41.59 51.12,41.59 v51.12,41.85
  Bottom 0.254: v51.12,41.85 51.12,39.05 v50.8,38.73
REF
  Top 0.254: C10.1 R12.2 R2.2 41.91,41.59 42.42,42.1 44.96,42.1 45.4,42.55 IC6.8
RESET
  Top 0.254: RST.2 40.32,7.02 | SJ1.2 40.32,7.02 | 40.32,7.02 RST.1 44.21,6.39 61.35,6.39 62.12,7.15 IC4.29 | R23.2 36.52,3.81 37.15,4.45 37.15,6.95 RST.2 | J1.5 31.75,7.94 32.66,7.02 RST.2
RX  (via drill 0.61)
  Top 0.254: J1.4 v30.48,20.64 | IC4.30 62.93,6.1 v62.86,6.03
  Bottom 0.254: v62.86,6.03 62.86,8.57 62.42,9.02 36.54,9.02 36.26,9.29 36.26,19.62 35.88,20 30.8,20 30.48,20.32 v30.48,20.64
SCK  (via drill 0.61)
  Top 0.254: J1.7 v33.02,13.02 | IC4.17 57.15,16.32 v57.15,16.83
  Bottom 0.254: v33.02,13.02 33.02,17.78 32.7,18.1 29.53,18.1 28.89,18.73 28.89,21.91 29.46,22.48 38.52,22.48 39.29,21.72 57.98,21.72 58.42,21.27 58.42,19.88 58.38,19.84 58.38,17.1 58.1,16.83 v57.15,16.83
SCL  (via drill 0.61)
  Top 0.254: TUBES.3 11.75,20.32 12.38,19.69 20,19.69 20.64,20.32 | 20.64,20.32 R26.2 | IC4.28 61.33,10.21 61.91,10.79 v61.91,11.43 | v37.78,16.83 IC2.16 37.78,23.18 37.47,23.49 25.4,23.49 25.08,23.18 25.08,20.64 24.77,20.32 24.13,20.32 20.64,20.32
  Bottom 0.254: v37.78,16.83 37.78,10.48 38.1,10.16 61.59,10.16 61.91,10.48 v61.91,11.43
SDA  (via drill 0.61)
  Top 0.254: R27.2 18.09,20.64 17.78,20.32 13.02,20.32 12.7,20.64 12.7,22.54 12.38,22.86 | IC4.27 60.54,11.01 v60.64,11.11 | v39.05,16.83 IC2.15 39.05,23.88 38.8,24.13 v24.77,24.13
  Top 0.305: R27.2 v18.09,23.81 v18.1,23.81 | 12.38,22.86 TUBES.2
  Bottom 0.254: v60.64,11.11 39.37,11.11 39.05,11.43 v39.05,16.83 | v24.77,24.13 18.41,24.13
  Bottom 0.305: v18.1,23.81 18.41,24.13
TX  (via drill 0.61)
  Top 0.254: J1.6 v31.75,20.95 | IC4.31 63.82,8.87 v63.82,4.45
  Bottom 0.254: v31.75,20.95 36.51,20.95 36.89,20.57 36.89,10.01 37.38,9.53 63.5,9.53 63.82,9.21 v63.82,4.45
VCC  (1 unrouted)
  Top 0.254: C8.2 47.44,45.85 46.67,45.09 IC6.7
  Top 0.813: L2.2 46.31,46.4 46.86,45.85 C8.2
  Top 1.016: L3.1 29.48,49.53 46.17,49.53

### Text on the board
tNames: + | + | + | 5 | + | www.steamclock.ch | Mark 1.4.1